# EAGLE design mosfet (EAGLE 7.6.0)
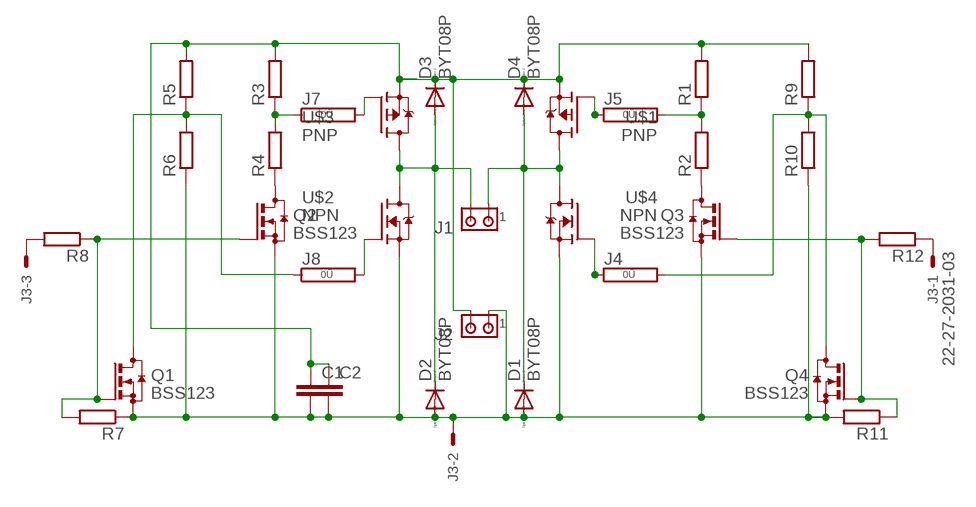
[diagram p0: schematic, sheet 1]

## Parts
C1  C-EUC0805  [C0805]
C2  C-EUC0805  [C0805]
D1  BYT08P  [TO220ACS]
D2  BYT08P  [TO220ACS]
D3  BYT08P  [TO220ACS]
D4  BYT08P  [TO220ACS]
J1  MTA02-156  [1X2MTA]
J2  MTA02-156  [1X2MTA]
J3  22-27-2031-03  [6410-03]
J4  0R  [0R/10]
J5  0R  [0R/10]
J7  0R  [0R/10]
J8  0R  [0R/10]
Q1  BSS123  [SOT23]
Q2  BSS123  [SOT23]
Q3  BSS123  [SOT23]
Q4  BSS123  [SOT23]
R1  R-EU_R0805  [R0805]
R2  R-EU_R0805  [R0805]
R3  R-EU_R0805  [R0805]
R4  R-EU_R0805  [R0805]
R5  R-EU_R0805  [R0805]
R6  R-EU_R0805  [R0805]
R7  R-EU_R0805  [R0805]
R8  R-EU_R0805  [R0805]
R9  R-EU_R0805  [R0805]
R10  R-EU_R0805  [R0805]
R11  R-EU_R0805  [R0805]
R12  R-EU_R0805  [R0805]
U$1  PNP  [TO-220]
U$2  NPN  [TO-247]
U$3  PNP  [TO-220]
U$4  NPN  [TO-247]

## Nets
24V: C1.1 C2.1 D3.C D4.C J2.2 R1.2 R3.2 R5.2 R9.2 U$1.3(S) U$3.3(S)
GND: C1.2 C2.2 D1.A D2.A J2.1 J3.2 Q1.2(S) Q2.2(S) Q3.2(S) Q4.2(S) R6.1 R7.1 R10.1 R11.2 U$2.P$3(S) U$4.P$3(S)
M1: D2.C D3.A J1.2 U$2.P$2(D) U$3.2(D)
M2: D1.C D4.A J1.1 U$1.2(D) U$4.P$2(D)
N$1: J5.1 U$1.1(G)
N$4: J7.2 U$3.1(G)
N$5: J3.3 R8.2
N$6: Q2.3(D) R4.1
N$7: Q3.3(D) R2.1
N$8: J8.2 U$2.P$1(G)
N$9: J8.1 Q1.3(D) R5.1 R6.2
N$10: J7.1 R3.1 R4.2
N$11: Q1.1(G) Q2.1(G) R7.2 R8.1
N$12: J4.2 Q4.3(D) R9.1 R10.2
N$13: Q3.1(G) Q4.1(G) R11.1 R12.2
N$14: J5.2 R1.1 R2.2
N$15: J4.1 U$4.P$1(G)
N$16: J3.1 R12.1

## Library data of the parts
C1 C2 = resistor:C-EU: CAPACITOR, European symbol
D1-D4 = diode:BYT08P: DIODE ultra fast
J1 J2 = con-amp:MTA02-156: AMP connector
J3 = con-molex:22-?-03: CONNECTOR wire to board 2.54 mm (.1 inch) pitch header; OC_FARNELL: unknown; OC_NEWARK: unknown
J4 J5 J7 J8 = jumper:0R: Bridge 0R 10mm
Q1-Q4 = transistor-small-signal:BSS123: N-CHANNEL MOS FET
R1-R12 = resistor:R-EU_: RESISTOR, European symbol
U$1 U$3 = to-247_n-channel_igbt:PNP
U$2 U$4 = to-247_n-channel_igbt:NPN

## Board
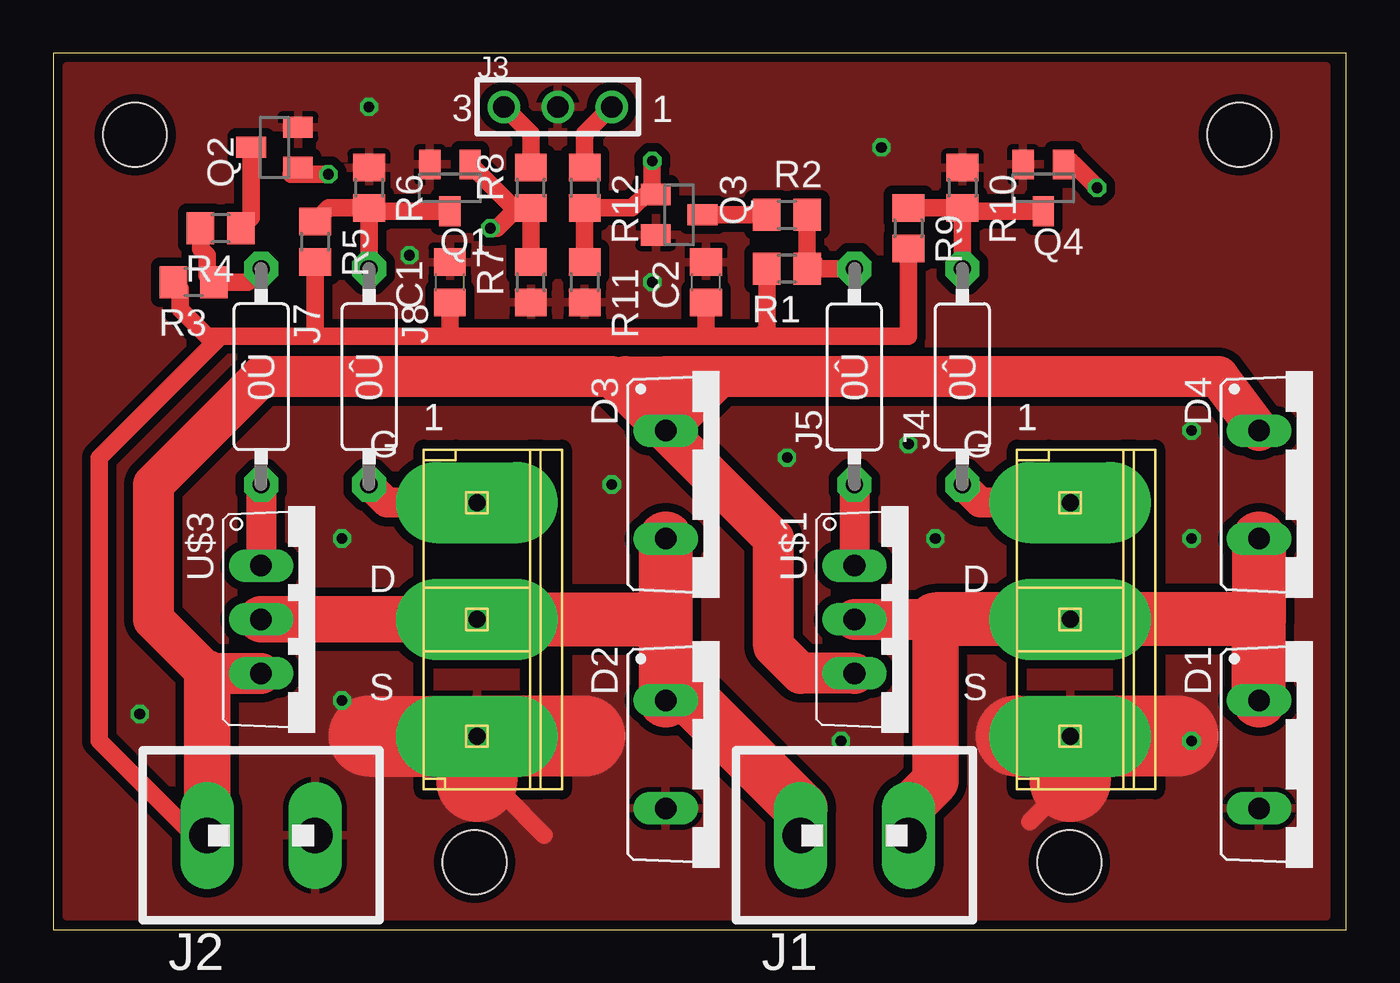
[diagram p1: board, top side]
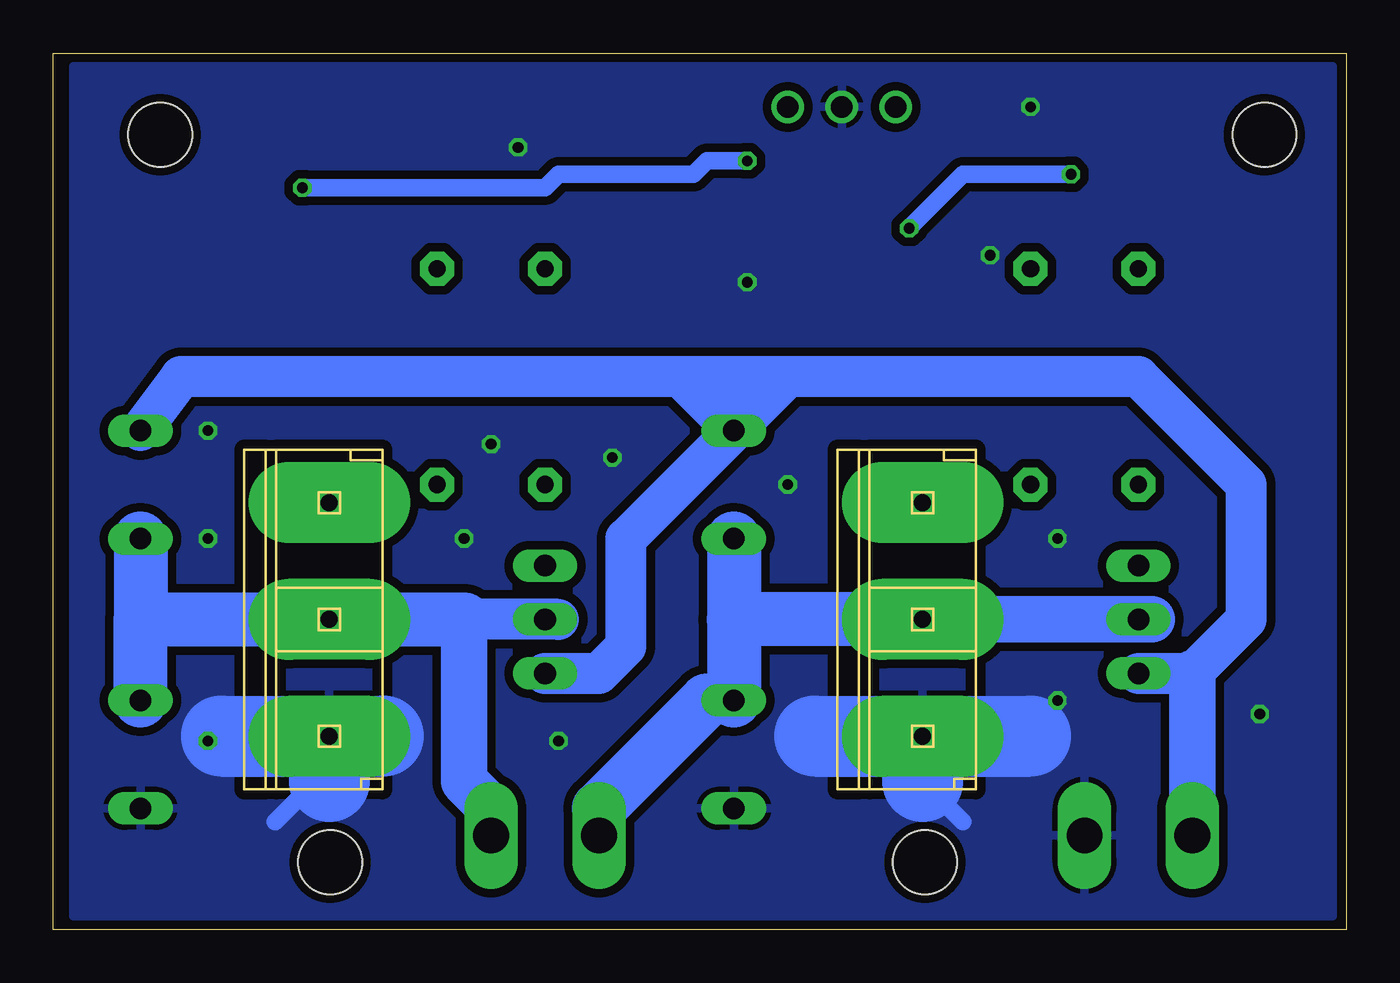
[diagram p2: board, bottom side, seen from below]

Size 60.9 x 41.27 mm. Coordinates in mm from the lower left corner, seen from the top.
Outline: 0,0 60.9,0 60.9,41.27 0,41.27 0,0
Copper layers (1*16): Top 0.0356mm / dielectric 1.5011mm / Bottom 0.0356mm
Design rules "oshpark-2layer *": minimum track width 6mil, minimum drill 13mil, track to track 6mil, track to pad 6mil, pad to pad 6mil, via to via 6mil, smd to smd 6mil, copper to edge 15mil, drill to drill 6mil, minimum pad ring 7mil, minimum via ring 7mil, stop-mask expansion 2.5mil, vias tented up to drill 20mil, thermal gap 10mil
Holes 3 mm at 55.86,37.42 3.86,37.42 19.86,3.18 47.86,3.18
tKeepout: area 52.9,34.4 to 58.9,40.4; area 0.9,34.4 to 6.9,40.4; area 16.9,0.2 to 22.9,6.2; area 44.9,0.2 to 50.9,6.2

### Footprints (pad centres in the part's own frame; a part is rotated, then mirrored left to right if it is on the bottom)
C0805 = smd 1.3 x 1.5: 1 -0.95,0; 2 0.95,0
TO220ACS = drill 1.016 long: A 2.54,-2.54; C -2.54,-2.54
1X2MTA = drill 1.676 long: 1 2.54,0; 2 -2.54,0
6410-03 = drill 1.016: 1 2.54,0; 2 0,0; 3 -2.54,0
0R/10 = drill 0.813 pad 1.6 octagon: 1 -5.08,0; 2 5.08,0
SOT23 = smd 1 x 1.4: 1 -0.95,-1.1; 2 0.95,-1.1; 3 0,1.1
R0805 = smd 1.3 x 1.5: 1 -0.95,0; 2 0.95,0
TO-220 = drill 1.016 long: 1 -2.54,0; 2 0,0; 3 2.54,0
TO-247 = drill 0.8 pad 3.81 long: P$1 0,5.5; P$2 0,0; P$3 0,-5.5

### Placement (x,y rotation side)
C1  18.68,30.48 90 top
C2  30.75,30.48 90 top
D1  59.33,8.25 270 top
D2  31.39,8.25 270 top
D3  31.39,20.96 270 top
D4  59.33,20.96 270 top
J1  37.73,4.45 0 top
J2  9.8,4.45 0 top
J3  23.76,38.73 0 top
J4  42.81,26.04 90 top
J5  37.73,26.04 90 top
J7  9.8,26.04 270 top
J8  14.88,26.04 270 top
Q1  18.68,34.92 180 top
Q2  10.43,36.83 90 top
Q3  29.48,33.66 270 top
Q4  46.62,34.92 180 top
R1  34.56,31.11 180 top
R2  34.56,33.66 0 top
R3  6.62,30.48 180 top
R4  7.89,33.02 180 top
R5  12.34,32.39 270 top
R6  14.88,34.92 270 top
R7  22.5,30.48 90 top
R8  22.5,34.92 90 top
R9  40.28,33.02 270 top
R10  42.81,34.92 270 top
R11  25.04,30.48 270 top
R12  25.04,34.92 270 top
U$1  37.73,14.61 270 top
U$2  19.96,14.61 0 top
U$3  9.8,14.61 270 top
U$4  47.9,14.61 0 top

### Tracks (layer width: path | path; a pad name or v marks a point on that pad's centre or on a via)
24V
  Top 0.813: 33.61,26.36 33.29,26.04 | 9.16,26.04 9.8,26.04 | R9.2 40.28,27.94 33.29,27.94 | 33.29,27.94 30.75,27.94 | 30.75,27.94 18.68,27.94 | 18.68,27.94 12.34,27.94 | 12.34,27.94 7.89,27.94 | 7.89,27.94 2.18,22.22 2.18,8.89 6.62,4.45 J2.2 | R1.2 33.61,28.26 33.29,27.94 | R5.2 12.34,27.94 | 7.89,27.94 7.25,27.94 5.98,29.21 5.98,30.17 R3.2 | C2.1 30.75,27.94 | C1.1 18.68,27.94
  Top 1.93: D4.C 54.88,26.04 33.29,26.04 31.39,26.04 | 31.39,26.04 D3.C | U$1.3 35.2,12.07 33.92,13.33 33.92,18.42 D3.C | D3.C 26.31,26.04 9.8,26.04 4.71,20.96 4.71,14.61 7.25,12.07 U$3.3 | 31.39,26.04 28.85,26.04 | 26.94,26.04 28.85,26.04 | 28.85,26.04 28.85,24.77
  Top 2.184: 7.25,12.07 J2.2
  Bottom 1.93: 26.31,26.04 9.8,26.04 4.71,20.96 4.71,14.61 7.25,12.07 U$3.3 | 26.31,26.04 28.85,26.04 | 31.39,26.04 54.88,26.04 D4.C | U$1.3 35.2,12.07 33.92,13.33 33.92,18.42 D3.C | D3.C 28.85,26.04 | 28.85,26.04 31.39,26.04 | 31.39,26.04 D3.C | D3.C 26.31,26.04
  Bottom 2.184: J2.2 7.25,12.07
GND  (via drill 0.5)
  Top 0.813: 19.96,6.99 21.22,6.35 23.13,4.45 | 47.9,6.99 45.99,5.08
  Top 3.81: 25.04,9.11 U$2.P$3 | 14.88,9.11 U$2.P$3 | U$2.P$3 19.96,6.99 | U$4.P$3 47.9,6.99 | 45.36,9.11 U$4.P$3 | 52.98,9.11 U$4.P$3
  Bottom 0.813: 19.96,6.99 18.05,5.08 | 47.9,6.99 49.17,6.35 50.44,5.08
  Bottom 3.81: 52.98,9.11 45.36,9.11 | 25.04,9.11 14.88,9.11 | 19.96,7.85 19.96,6.99 | 47.9,8.48 47.9,6.99
  other vias: 16.78,31.75 4.08,10.16 13.61,18.42 13.61,10.79 26.31,20.96 37.1,8.89 34.56,22.22 40.28,22.86 41.55,18.42 53.61,18.42 53.61,23.5 53.61,8.89 28.21,30.48 39,36.83 14.88,38.73
  pour Top (isolate 0.406): 0.64,40.64 59.96,40.64 59.96,0.64 0.64,0.64
  pour Bottom (isolate 0.406): 0.64,40.64 59.96,40.64 59.96,0.64 0.64,0.64
M1
  Top 2.184: U$2.P$2 U$3.2 | J1.2 35.2,5.71 | 30.11,10.79 D2.C
  Top 2.54: D3.A 28.85,14.61 | 28.85,14.61 D2.C | U$2.P$2 28.85,14.61 | 35.2,5.71 30.11,10.79
  Bottom 1.93: J1.2 35.2,5.71 | 30.11,10.79 D2.C
  Bottom 2.184: 9.16,14.61 U$2.P$2
  Bottom 2.54: 35.2,5.71 30.11,10.79 | D3.A 28.85,14.61 | 28.85,14.61 D2.C | U$2.P$2 28.85,14.61
M2
  Top 1.93: U$1.2 41.55,14.61 | J1.1 40.28,5.71
  Top 2.184: 40.28,5.71 41.55,6.99 41.55,14.61
  Top 2.54: 41.55,14.61 U$4.P$2 56.79,14.61 | D4.A 56.79,14.61 | D1.C 56.79,14.61
  Bottom 1.93: 37.1,14.61 41.55,14.61 | 40.28,5.71 J1.1
  Bottom 2.184: 41.55,14.61 41.55,6.99 40.28,5.71
  Bottom 2.54: D1.C 56.79,14.61 | D4.A 56.79,14.61 | 56.79,14.61 41.55,14.61
N$1
  Top 1.422: J5.1 U$1.1
N$4
  Top 1.422: J7.2 U$3.1
N$5
  Top 0.813: R8.2 22.5,37.47 J3.3
N$6
  Top 0.813: 8.84,33.34 R4.1 9.33,33.51 Q2.3
N$7
  Top 0.813: R2.1 Q3.3
N$8
  Top 1.422: U$2.P$1 15.72,20.11 J8.2
N$9
  Top 0.813: R6.2 J8.1 | Q1.3 15.66,33.83 R6.2 | R6.2 12.98,33.97 R5.1
N$10
  Top 0.813: J7.1 9.16,30.48 R3.1 7.25,30.79 7.25,31.75 6.94,32.06 R4.2
N$11  (via drill 0.5)
  Top 0.813: 21.86,33.97 R8.1 R7.2 | 21.86,33.97 21.68,33.97 Q1.1 | v20.59,33.02 20.9,33.02 21.86,33.97 | v12.97,35.56 11.21,35.56 Q2.1
  Bottom 0.813: v12.97,35.56 18.05,35.56 v20.59,33.02
N$12
  Top 0.813: J4.2 R10.2 | Q4.3 43.6,33.83 R10.2 | R10.2 R9.1
N$13  (via drill 0.5)
  Top 0.813: 47.73,35.88 Q4.1 | Q4.1 47.73,36.02 47.9,36.19 | Q3.1 27.89,34.61 | 27.89,34.61 27.26,33.97 R12.2 R11.1 | Q4.1 48.06,36.02 v49.17,34.92 | v28.21,36.19 28.21,34.92 27.89,34.61
  Bottom 0.813: v49.17,34.92 37.73,34.92 37.1,35.56 30.75,35.56 30.11,36.19 v28.21,36.19
N$14
  Top 0.813: J5.2 35.83,31.11 | 35.83,31.11 R1.1 35.83,31.43 35.83,31.11 | R2.2 35.51,31.43 35.83,31.11
N$15
  Top 1.422: U$4.P$1 43.67,20.11 J4.1
N$16
  Top 0.813: R12.1 25.04,37.47 J3.1